# Altium schematic sheet module.SchDoc
size A0
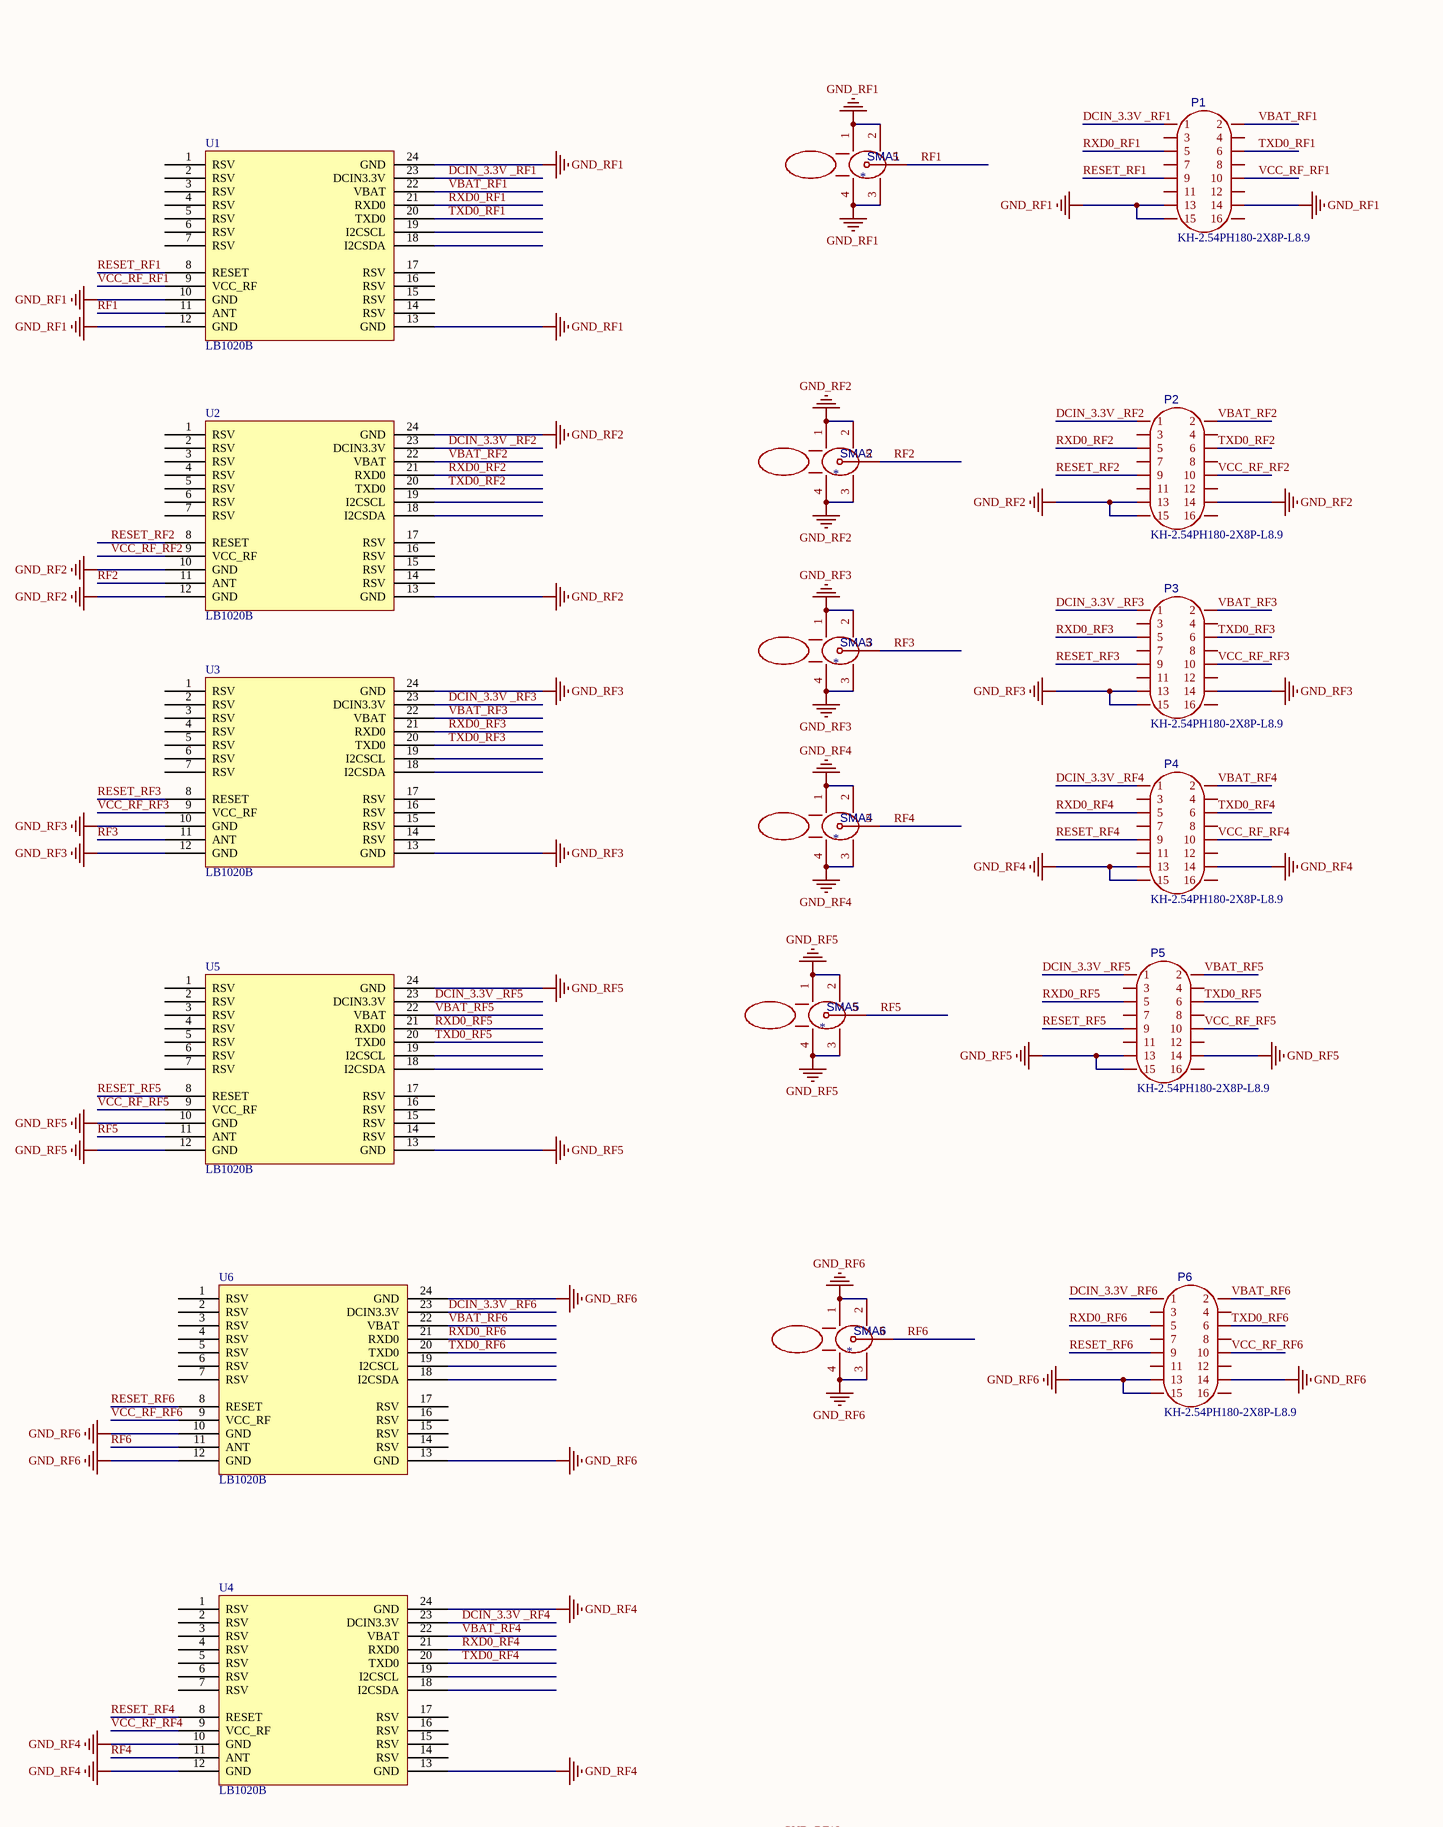
[diagram p0: module.SchDoc, top left]
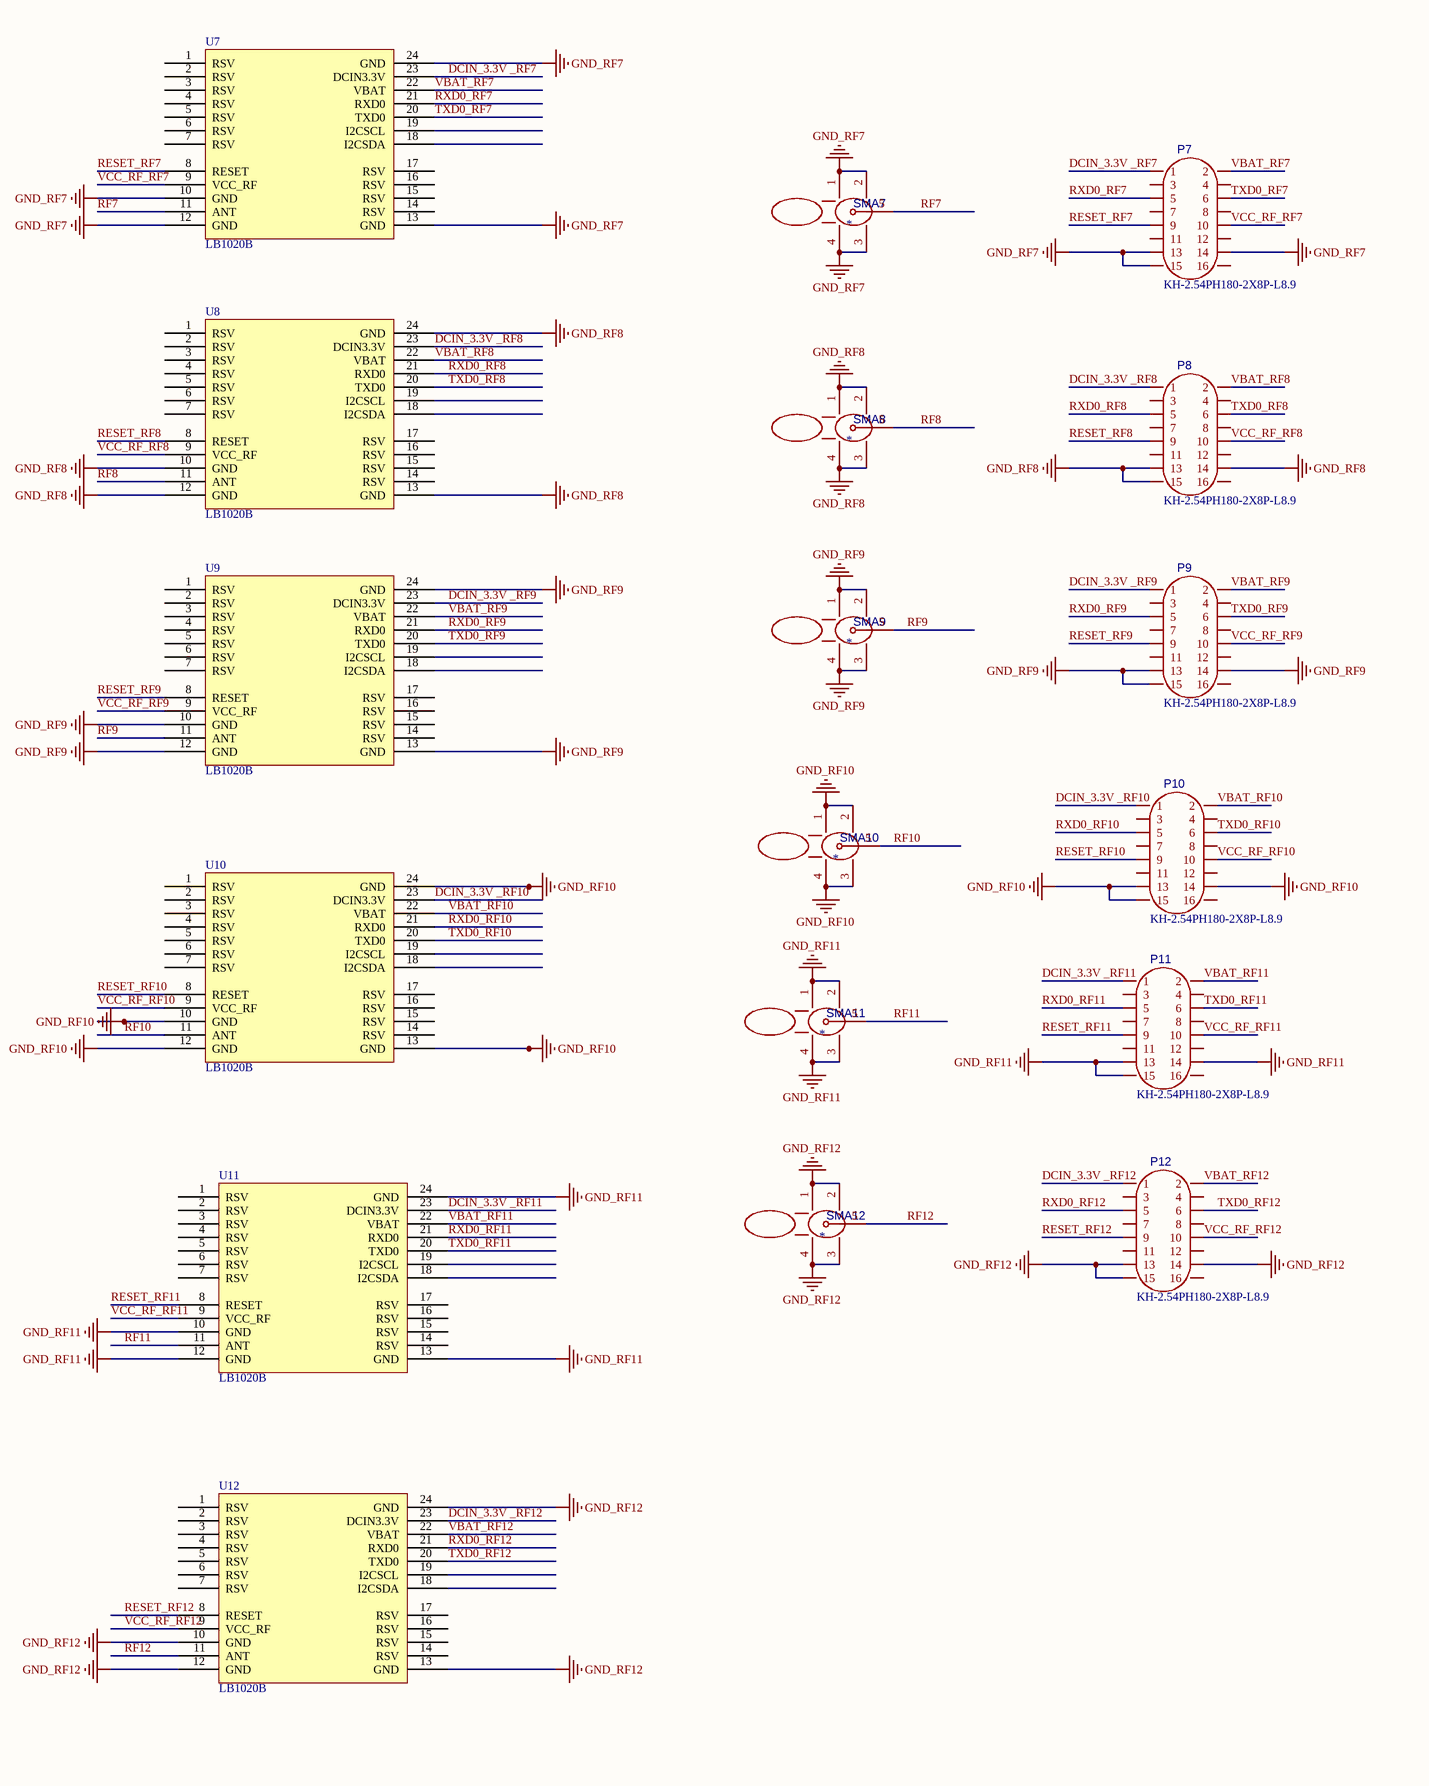
[diagram p1: module.SchDoc, top right]
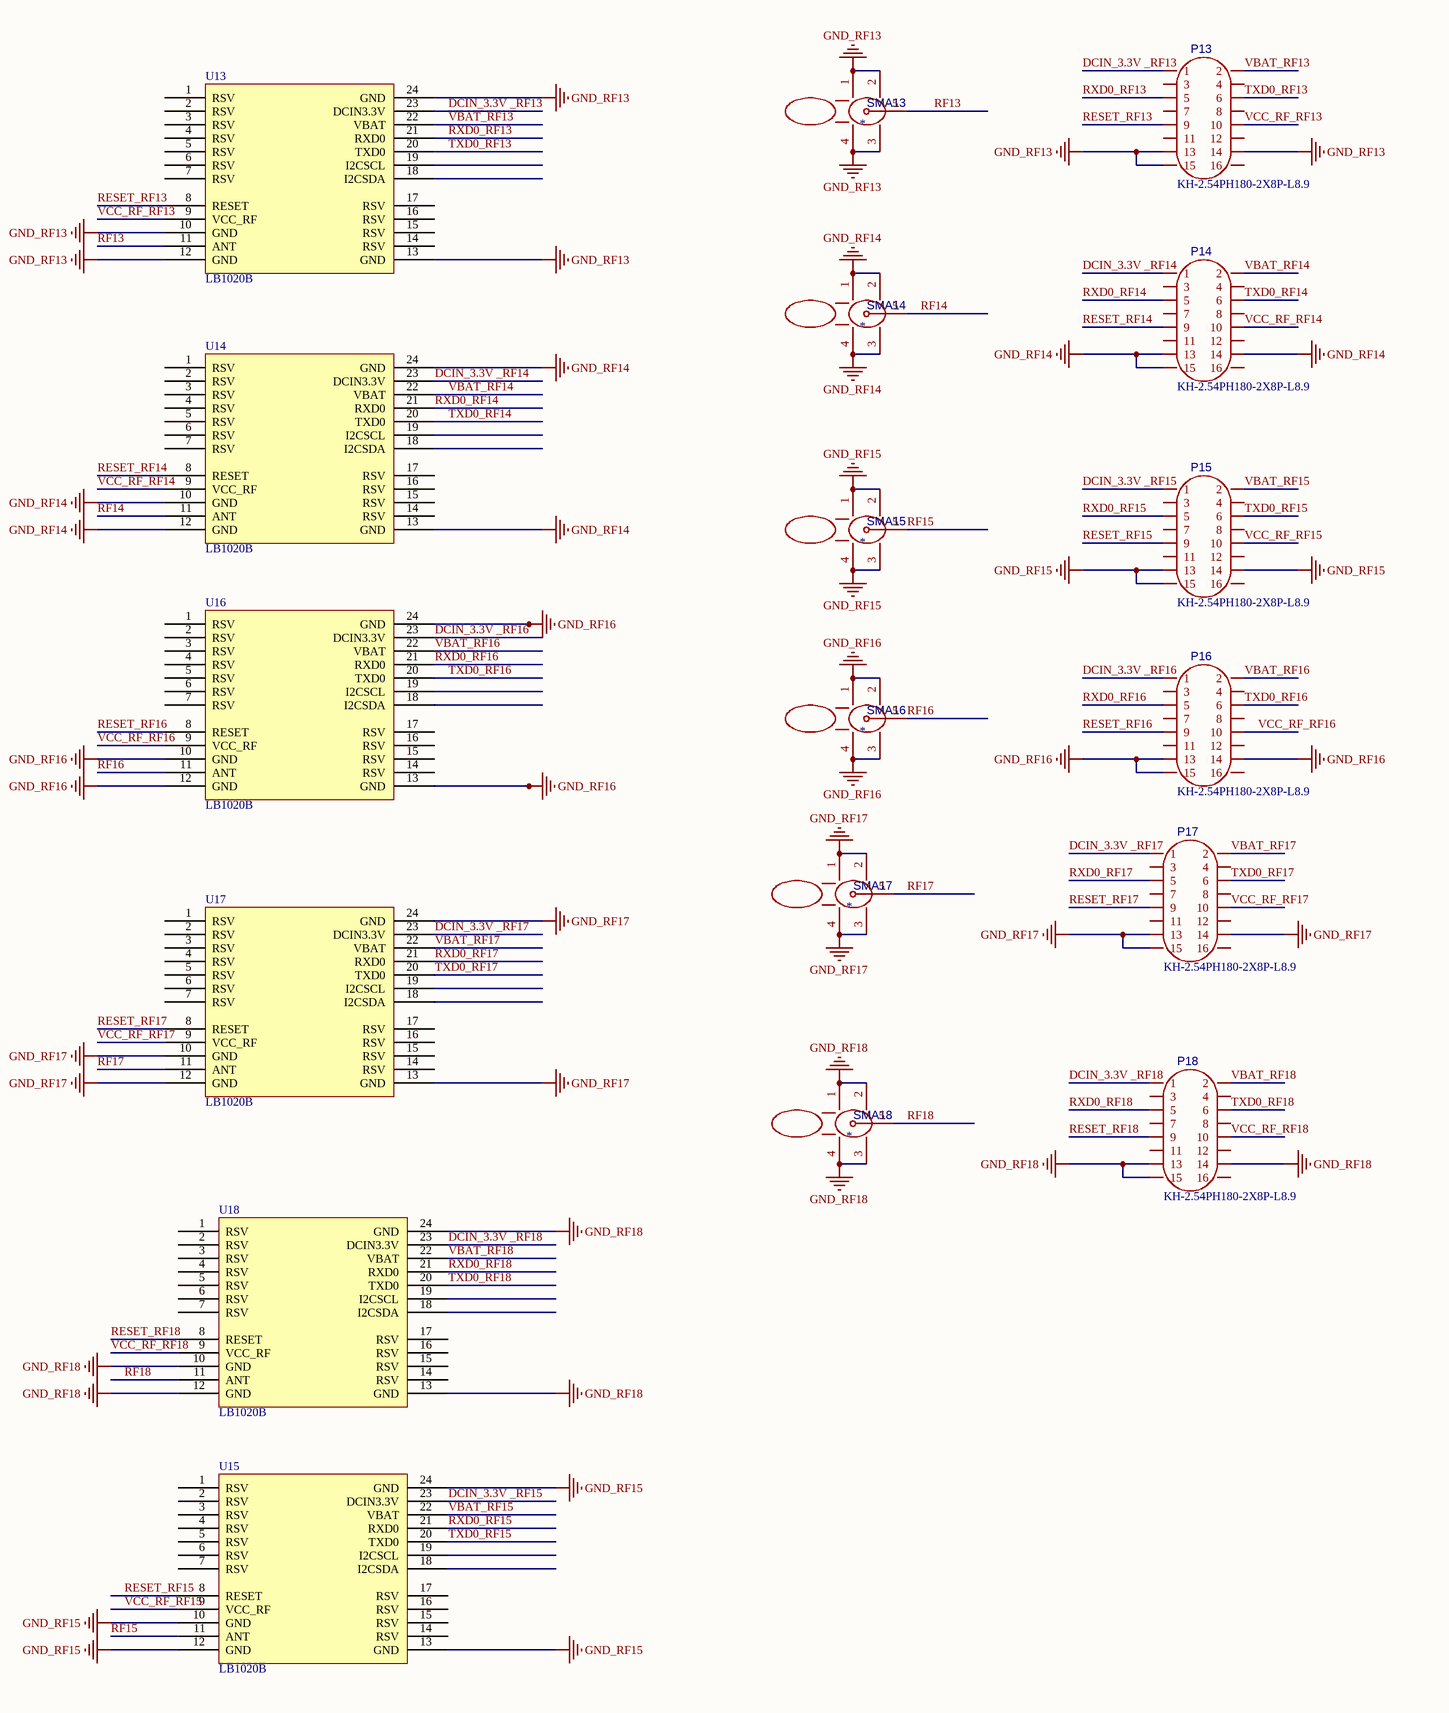
[diagram p2: module.SchDoc, bottom left]
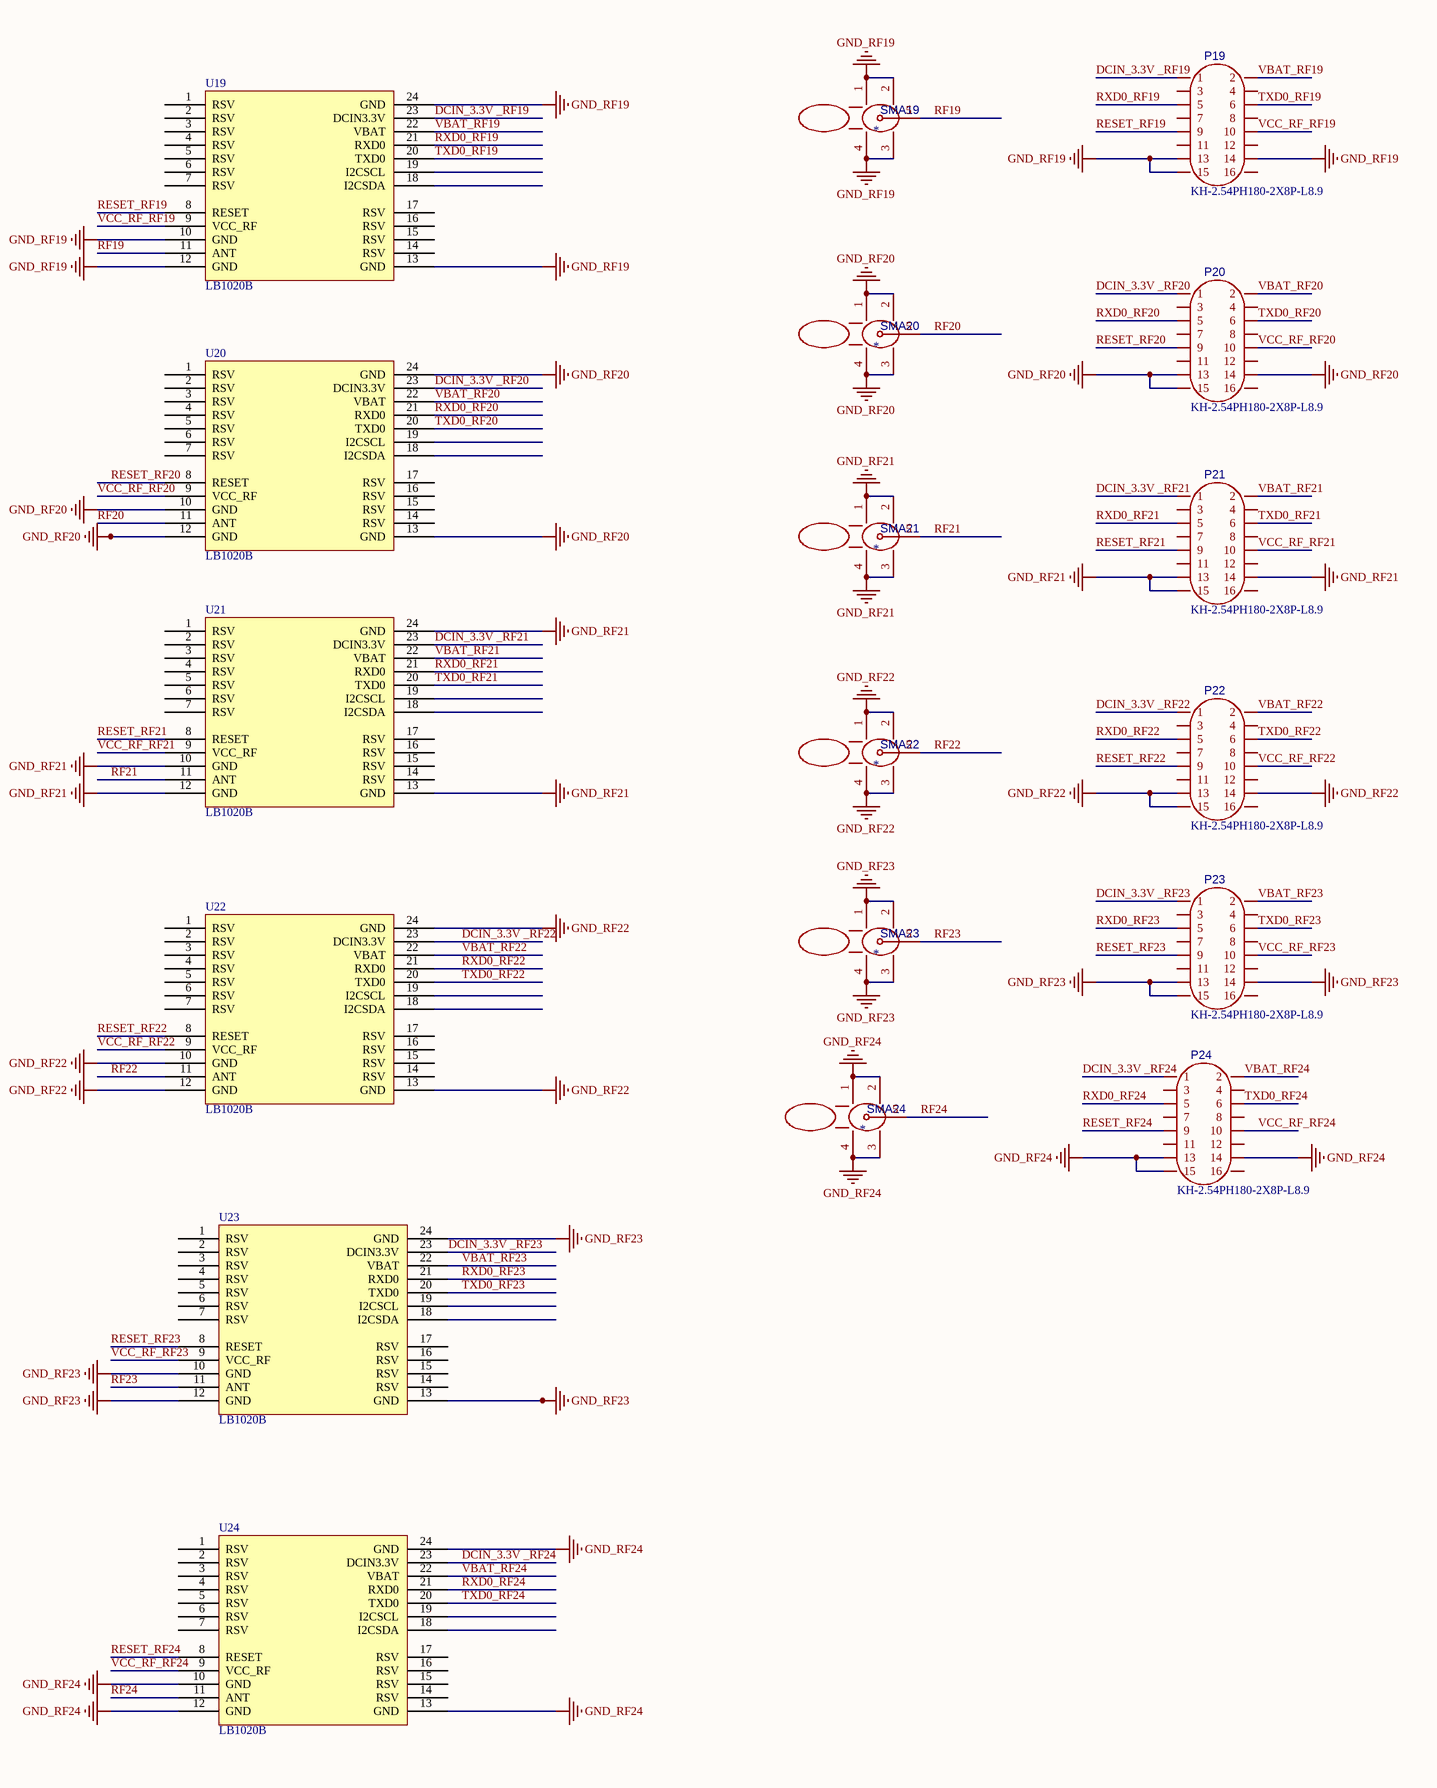
[diagram p3: module.SchDoc, bottom right]

## Parts
P1  KH-2.54PH180-2X8P-L8.9  [IDC-TH_16P-P2.54_C3406]
P2  KH-2.54PH180-2X8P-L8.9  [IDC-TH_16P-P2.54_C3406]
P3  KH-2.54PH180-2X8P-L8.9  [IDC-TH_16P-P2.54_C3406]
P4  KH-2.54PH180-2X8P-L8.9  [IDC-TH_16P-P2.54_C3406]
P5  KH-2.54PH180-2X8P-L8.9  [IDC-TH_16P-P2.54_C3406]
P6  KH-2.54PH180-2X8P-L8.9  [IDC-TH_16P-P2.54_C3406]
P7  KH-2.54PH180-2X8P-L8.9  [IDC-TH_16P-P2.54_C3406]
P8  KH-2.54PH180-2X8P-L8.9  [IDC-TH_16P-P2.54_C3406]
P9  KH-2.54PH180-2X8P-L8.9  [IDC-TH_16P-P2.54_C3406]
P10  KH-2.54PH180-2X8P-L8.9  [IDC-TH_16P-P2.54_C3406]
P11  KH-2.54PH180-2X8P-L8.9  [IDC-TH_16P-P2.54_C3406]
P12  KH-2.54PH180-2X8P-L8.9  [IDC-TH_16P-P2.54_C3406]
P13  KH-2.54PH180-2X8P-L8.9  [IDC-TH_16P-P2.54_C3406]
P14  KH-2.54PH180-2X8P-L8.9  [IDC-TH_16P-P2.54_C3406]
P15  KH-2.54PH180-2X8P-L8.9  [IDC-TH_16P-P2.54_C3406]
P16  KH-2.54PH180-2X8P-L8.9  [IDC-TH_16P-P2.54_C3406]
P17  KH-2.54PH180-2X8P-L8.9  [IDC-TH_16P-P2.54_C3406]
P18  KH-2.54PH180-2X8P-L8.9  [IDC-TH_16P-P2.54_C3406]
P19  KH-2.54PH180-2X8P-L8.9  [IDC-TH_16P-P2.54_C3406]
P20  KH-2.54PH180-2X8P-L8.9  [IDC-TH_16P-P2.54_C3406]
P21  KH-2.54PH180-2X8P-L8.9  [IDC-TH_16P-P2.54_C3406]
P22  KH-2.54PH180-2X8P-L8.9  [IDC-TH_16P-P2.54_C3406]
P23  KH-2.54PH180-2X8P-L8.9  [IDC-TH_16P-P2.54_C3406]
P24  KH-2.54PH180-2X8P-L8.9  [IDC-TH_16P-P2.54_C3406]
SMA1  *  [SMA-TH_HL-SMA-KHD4]
SMA2  *  [SMA-TH_HL-SMA-KHD4]
SMA3  *  [SMA-TH_HL-SMA-KHD4]
SMA4  *  [SMA-TH_HL-SMA-KHD4]
SMA5  *  [SMA-TH_HL-SMA-KHD4]
SMA6  *  [SMA-TH_HL-SMA-KHD4]
SMA7  *  [SMA-TH_HL-SMA-KHD4]
SMA8  *  [SMA-TH_HL-SMA-KHD4]
SMA9  *  [SMA-TH_HL-SMA-KHD4]
SMA10  *  [SMA-TH_HL-SMA-KHD4]
SMA11  *  [SMA-TH_HL-SMA-KHD4]
SMA12  *  [SMA-TH_HL-SMA-KHD4]
SMA13  *  [SMA-TH_HL-SMA-KHD4]
SMA14  *  [SMA-TH_HL-SMA-KHD4]
SMA15  *  [SMA-TH_HL-SMA-KHD4]
SMA16  *  [SMA-TH_HL-SMA-KHD4]
SMA17  *  [SMA-TH_HL-SMA-KHD4]
SMA18  *  [SMA-TH_HL-SMA-KHD4]
SMA19  *  [SMA-TH_HL-SMA-KHD4]
SMA20  *  [SMA-TH_HL-SMA-KHD4]
SMA21  *  [SMA-TH_HL-SMA-KHD4]
SMA22  *  [SMA-TH_HL-SMA-KHD4]
SMA23  *  [SMA-TH_HL-SMA-KHD4]
SMA24  *  [SMA-TH_HL-SMA-KHD4]
U1  LB1020B  [LB1020B]
U2  LB1020B  [LB1020B]
U3  LB1020B  [LB1020B]
U4  LB1020B  [LB1020B]
U5  LB1020B  [LB1020B]
U6  LB1020B  [LB1020B]
U7  LB1020B  [LB1020B]
U8  LB1020B  [LB1020B]
U9  LB1020B  [LB1020B]
U10  LB1020B  [LB1020B]
U11  LB1020B  [LB1020B]
U12  LB1020B  [LB1020B]
U13  LB1020B  [LB1020B]
U14  LB1020B  [LB1020B]
U15  LB1020B  [LB1020B]
U16  LB1020B  [LB1020B]
U17  LB1020B  [LB1020B]
U18  LB1020B  [LB1020B]
U19  LB1020B  [LB1020B]
U20  LB1020B  [LB1020B]
U21  LB1020B  [LB1020B]
U22  LB1020B  [LB1020B]
U23  LB1020B  [LB1020B]
U24  LB1020B  [LB1020B]

## Nets
GND_RF1: P1.13 P1.14 P1.15 SMA1.1 SMA1.2 SMA1.3 SMA1.4 U1.10(GND) U1.12(GND) U1.13(GND) U1.24(GND)
GND_RF2: P2.13 P2.14 P2.15 SMA2.1 SMA2.2 SMA2.3 SMA2.4 U2.10(GND) U2.12(GND) U2.13(GND) U2.24(GND)
GND_RF3: P3.13 P3.14 P3.15 SMA3.1 SMA3.2 SMA3.3 SMA3.4 U3.10(GND) U3.12(GND) U3.13(GND) U3.24(GND)
GND_RF4: P4.13 P4.14 P4.15 SMA4.1 SMA4.2 SMA4.3 SMA4.4 U4.10(GND) U4.12(GND) U4.13(GND) U4.24(GND)
GND_RF5: P5.13 P5.14 P5.15 SMA5.1 SMA5.2 SMA5.3 SMA5.4 U5.10(GND) U5.12(GND) U5.13(GND) U5.24(GND)
GND_RF6: P6.13 P6.14 P6.15 SMA6.1 SMA6.2 SMA6.3 SMA6.4 U6.10(GND) U6.12(GND) U6.13(GND) U6.24(GND)
GND_RF7: P7.13 P7.14 P7.15 SMA7.1 SMA7.2 SMA7.3 SMA7.4 U7.10(GND) U7.12(GND) U7.13(GND) U7.24(GND)
GND_RF8: P8.13 P8.14 P8.15 SMA8.1 SMA8.2 SMA8.3 SMA8.4 U8.10(GND) U8.12(GND) U8.13(GND) U8.24(GND)
GND_RF9: P9.13 P9.14 P9.15 SMA9.1 SMA9.2 SMA9.3 SMA9.4 U9.10(GND) U9.12(GND) U9.13(GND) U9.24(GND)
GND_RF10: P10.13 P10.14 P10.15 SMA10.1 SMA10.2 SMA10.3 SMA10.4 U10.10(GND) U10.12(GND) U10.13(GND) U10.24(GND)
GND_RF11: P11.13 P11.14 P11.15 SMA11.1 SMA11.2 SMA11.3 SMA11.4 U11.10(GND) U11.12(GND) U11.13(GND) U11.24(GND)
GND_RF12: P12.13 P12.14 P12.15 SMA12.1 SMA12.2 SMA12.3 SMA12.4 U12.10(GND) U12.12(GND) U12.13(GND) U12.24(GND)
GND_RF13: P13.13 P13.14 P13.15 SMA13.1 SMA13.2 SMA13.3 SMA13.4 U13.10(GND) U13.12(GND) U13.13(GND) U13.24(GND)
GND_RF14: P14.13 P14.14 P14.15 SMA14.1 SMA14.2 SMA14.3 SMA14.4 U14.10(GND) U14.12(GND) U14.13(GND) U14.24(GND)
GND_RF15: P15.13 P15.14 P15.15 SMA15.1 SMA15.2 SMA15.3 SMA15.4 U15.10(GND) U15.12(GND) U15.13(GND) U15.24(GND)
GND_RF16: P16.13 P16.14 P16.15 SMA16.1 SMA16.2 SMA16.3 SMA16.4 U16.10(GND) U16.12(GND) U16.13(GND) U16.24(GND)
GND_RF17: P17.13 P17.14 P17.15 SMA17.1 SMA17.2 SMA17.3 SMA17.4 U17.10(GND) U17.12(GND) U17.13(GND) U17.24(GND)
GND_RF18: P18.13 P18.14 P18.15 SMA18.1 SMA18.2 SMA18.3 SMA18.4 U18.10(GND) U18.12(GND) U18.13(GND) U18.24(GND)
GND_RF19: P19.13 P19.14 P19.15 SMA19.1 SMA19.2 SMA19.3 SMA19.4 U19.10(GND) U19.12(GND) U19.13(GND) U19.24(GND)
GND_RF20: P20.13 P20.14 P20.15 SMA20.1 SMA20.2 SMA20.3 SMA20.4 U20.10(GND) U20.12(GND) U20.13(GND) U20.24(GND)
GND_RF21: P21.13 P21.14 P21.15 SMA21.1 SMA21.2 SMA21.3 SMA21.4 U21.10(GND) U21.12(GND) U21.13(GND) U21.24(GND)
GND_RF22: P22.13 P22.14 P22.15 SMA22.1 SMA22.2 SMA22.3 SMA22.4 U22.10(GND) U22.12(GND) U22.13(GND) U22.24(GND)
GND_RF23: P23.13 P23.14 P23.15 SMA23.1 SMA23.2 SMA23.3 SMA23.4 U23.10(GND) U23.12(GND) U23.13(GND) U23.24(GND)
GND_RF24: P24.13 P24.14 P24.15 SMA24.1 SMA24.2 SMA24.3 SMA24.4 U24.10(GND) U24.12(GND) U24.13(GND) U24.24(GND)
DCIN_3.3V _RF1: P1.1 U1.23(DCIN3.3V)
DCIN_3.3V _RF2: P2.1 U2.23(DCIN3.3V)
DCIN_3.3V _RF3: P3.1 U3.23(DCIN3.3V)
DCIN_3.3V _RF4: P4.1 U4.23(DCIN3.3V)
DCIN_3.3V _RF5: P5.1 U5.23(DCIN3.3V)
DCIN_3.3V _RF6: P6.1 U6.23(DCIN3.3V)
DCIN_3.3V _RF7: P7.1 U7.23(DCIN3.3V)
DCIN_3.3V _RF8: P8.1 U8.23(DCIN3.3V)
DCIN_3.3V _RF9: P9.1 U9.23(DCIN3.3V)
DCIN_3.3V _RF10: P10.1 U10.23(DCIN3.3V)
DCIN_3.3V _RF11: P11.1 U11.23(DCIN3.3V)
DCIN_3.3V _RF12: P12.1 U12.23(DCIN3.3V)
DCIN_3.3V _RF13: P13.1 U13.23(DCIN3.3V)
DCIN_3.3V _RF14: P14.1 U14.23(DCIN3.3V)
DCIN_3.3V _RF15: P15.1 U15.23(DCIN3.3V)
DCIN_3.3V _RF16: P16.1 U16.23(DCIN3.3V)
DCIN_3.3V _RF17: P17.1 U17.23(DCIN3.3V)
DCIN_3.3V _RF18: P18.1 U18.23(DCIN3.3V)
DCIN_3.3V _RF19: P19.1 U19.23(DCIN3.3V)
DCIN_3.3V _RF20: P20.1 U20.23(DCIN3.3V)
DCIN_3.3V _RF21: P21.1 U21.23(DCIN3.3V)
DCIN_3.3V _RF22: P22.1 U22.23(DCIN3.3V)
DCIN_3.3V _RF23: P23.1 U23.23(DCIN3.3V)
DCIN_3.3V _RF24: P24.1 U24.23(DCIN3.3V)
RESET_RF1: P1.9 U1.8(RESET)
RESET_RF2: P2.9 U2.8(RESET)
RESET_RF3: P3.9 U3.8(RESET)
RESET_RF4: P4.9 U4.8(RESET)
RESET_RF5: P5.9 U5.8(RESET)
RESET_RF6: P6.9 U6.8(RESET)
RESET_RF7: P7.9 U7.8(RESET)
RESET_RF8: P8.9 U8.8(RESET)
RESET_RF9: P9.9 U9.8(RESET)
RESET_RF10: P10.9 U10.8(RESET)
RESET_RF11: P11.9 U11.8(RESET)
RESET_RF12: P12.9 U12.8(RESET)
RESET_RF13: P13.9 U13.8(RESET)
RESET_RF14: P14.9 U14.8(RESET)
RESET_RF15: P15.9 U15.8(RESET)
RESET_RF16: P16.9 U16.8(RESET)
RESET_RF17: P17.9 U17.8(RESET)
RESET_RF18: P18.9 U18.8(RESET)
RESET_RF19: P19.9 U19.8(RESET)
RESET_RF20: P20.9 U20.8(RESET)
RESET_RF21: P21.9 U21.8(RESET)
RESET_RF22: P22.9 U22.8(RESET)
RESET_RF23: P23.9 U23.8(RESET)
RESET_RF24: P24.9 U24.8(RESET)
RF1: SMA1.5 U1.11(ANT)
RF2: SMA2.5 U2.11(ANT)
RF3: SMA3.5 U3.11(ANT)
RF4: SMA4.5 U4.11(ANT)
RF5: SMA5.5 U5.11(ANT)
RF6: SMA6.5 U6.11(ANT)
RF7: SMA7.5 U7.11(ANT)
RF8: SMA8.5 U8.11(ANT)
RF9: SMA9.5 U9.11(ANT)
RF10: SMA10.5 U10.11(ANT)
RF11: SMA11.5 U11.11(ANT)
RF12: SMA12.5 U12.11(ANT)
RF13: SMA13.5 U13.11(ANT)
RF14: SMA14.5 U14.11(ANT)
RF15: SMA15.5 U15.11(ANT)
RF16: SMA16.5 U16.11(ANT)
RF17: SMA17.5 U17.11(ANT)
RF18: SMA18.5 U18.11(ANT)
RF19: SMA19.5 U19.11(ANT)
RF20: SMA20.5 U20.11(ANT)
RF21: SMA21.5 U21.11(ANT)
RF22: SMA22.5 U22.11(ANT)
RF23: SMA23.5 U23.11(ANT)
RF24: SMA24.5 U24.11(ANT)
RXD0_RF1: P1.5 U1.21(RXD0)
RXD0_RF2: P2.5 U2.21(RXD0)
RXD0_RF3: P3.5 U3.21(RXD0)
RXD0_RF4: P4.5 U4.21(RXD0)
RXD0_RF5: P5.5 U5.21(RXD0)
RXD0_RF6: P6.5 U6.21(RXD0)
RXD0_RF7: P7.5 U7.21(RXD0)
RXD0_RF8: P8.5 U8.21(RXD0)
RXD0_RF9: P9.5 U9.21(RXD0)
RXD0_RF10: P10.5 U10.21(RXD0)
RXD0_RF11: P11.5 U11.21(RXD0)
RXD0_RF12: P12.5 U12.21(RXD0)
RXD0_RF13: P13.5 U13.21(RXD0)
RXD0_RF14: P14.5 U14.21(RXD0)
RXD0_RF15: P15.5 U15.21(RXD0)
RXD0_RF16: P16.5 U16.21(RXD0)
RXD0_RF17: P17.5 U17.21(RXD0)
RXD0_RF18: P18.5 U18.21(RXD0)
RXD0_RF19: P19.5 U19.21(RXD0)
RXD0_RF20: P20.5 U20.21(RXD0)
RXD0_RF21: P21.5 U21.21(RXD0)
RXD0_RF22: P22.5 U22.21(RXD0)
RXD0_RF23: P23.5 U23.21(RXD0)
RXD0_RF24: P24.5 U24.21(RXD0)
TXD0_RF1: P1.6 U1.20(TXD0)
TXD0_RF2: P2.6 U2.20(TXD0)
TXD0_RF3: P3.6 U3.20(TXD0)
TXD0_RF4: P4.6 U4.20(TXD0)
TXD0_RF5: P5.6 U5.20(TXD0)
TXD0_RF6: P6.6 U6.20(TXD0)
TXD0_RF7: P7.6 U7.20(TXD0)
TXD0_RF8: P8.6 U8.20(TXD0)
TXD0_RF9: P9.6 U9.20(TXD0)
TXD0_RF10: P10.6 U10.20(TXD0)
TXD0_RF11: P11.6 U11.20(TXD0)
TXD0_RF12: P12.6 U12.20(TXD0)
TXD0_RF13: P13.6 U13.20(TXD0)
TXD0_RF14: P14.6 U14.20(TXD0)
TXD0_RF15: P15.6 U15.20(TXD0)
TXD0_RF16: P16.6 U16.20(TXD0)
TXD0_RF17: P17.6 U17.20(TXD0)
TXD0_RF18: P18.6 U18.20(TXD0)
TXD0_RF19: P19.6 U19.20(TXD0)
TXD0_RF20: P20.6 U20.20(TXD0)
TXD0_RF21: P21.6 U21.20(TXD0)
TXD0_RF22: P22.6 U22.20(TXD0)
TXD0_RF23: P23.6 U23.20(TXD0)
TXD0_RF24: P24.6 U24.20(TXD0)
VBAT_RF1: P1.2 U1.22(VBAT)
VBAT_RF2: P2.2 U2.22(VBAT)
VBAT_RF3: P3.2 U3.22(VBAT)
VBAT_RF4: P4.2 U4.22(VBAT)
VBAT_RF5: P5.2 U5.22(VBAT)
VBAT_RF6: P6.2 U6.22(VBAT)
VBAT_RF7: P7.2 U7.22(VBAT)
VBAT_RF8: P8.2 U8.22(VBAT)
VBAT_RF9: P9.2 U9.22(VBAT)
VBAT_RF10: P10.2 U10.22(VBAT)
VBAT_RF11: P11.2 U11.22(VBAT)
VBAT_RF12: P12.2 U12.22(VBAT)
VBAT_RF13: P13.2 U13.22(VBAT)
VBAT_RF14: P14.2 U14.22(VBAT)
VBAT_RF15: P15.2 U15.22(VBAT)
VBAT_RF16: P16.2 U16.22(VBAT)
VBAT_RF17: P17.2 U17.22(VBAT)
VBAT_RF18: P18.2 U18.22(VBAT)
VBAT_RF19: P19.2 U19.22(VBAT)
VBAT_RF20: P20.2 U20.22(VBAT)
VBAT_RF21: P21.2 U21.22(VBAT)
VBAT_RF22: P22.2 U22.22(VBAT)
VBAT_RF23: P23.2 U23.22(VBAT)
VBAT_RF24: P24.2 U24.22(VBAT)
VCC_RF_RF1: P1.10 U1.9(VCC_RF)
VCC_RF_RF2: P2.10 U2.9(VCC_RF)
VCC_RF_RF3: P3.10 U3.9(VCC_RF)
VCC_RF_RF4: P4.10 U4.9(VCC_RF)
VCC_RF_RF5: P5.10 U5.9(VCC_RF)
VCC_RF_RF6: P6.10 U6.9(VCC_RF)
VCC_RF_RF7: P7.10 U7.9(VCC_RF)
VCC_RF_RF8: P8.10 U8.9(VCC_RF)
VCC_RF_RF9: P9.10 U9.9(VCC_RF)
VCC_RF_RF10: P10.10 U10.9(VCC_RF)
VCC_RF_RF11: P11.10 U11.9(VCC_RF)
VCC_RF_RF12: P12.10 U12.9(VCC_RF)
VCC_RF_RF13: P13.10 U13.9(VCC_RF)
VCC_RF_RF14: P14.10 U14.9(VCC_RF)
VCC_RF_RF15: P15.10 U15.9(VCC_RF)
VCC_RF_RF16: P16.10 U16.9(VCC_RF)
VCC_RF_RF17: P17.10 U17.9(VCC_RF)
VCC_RF_RF18: P18.10 U18.9(VCC_RF)
VCC_RF_RF19: P19.10 U19.9(VCC_RF)
VCC_RF_RF20: P20.10 U20.9(VCC_RF)
VCC_RF_RF21: P21.10 U21.9(VCC_RF)
VCC_RF_RF22: P22.10 U22.9(VCC_RF)
VCC_RF_RF23: P23.10 U23.9(VCC_RF)
VCC_RF_RF24: P24.10 U24.9(VCC_RF)

Not connected (* = marked no-connect by the designer): P1 3 4 7 8 11 12 16; P2 3 4 7 8 11 12 16; P3 3 4 7 8 11 12 16; P4 3 4 7 8 11 12 16; P5 3 4 7 8 11 12 16; P6 3 4 7 8 11 12 16; P7 3 4 7 8 11 12 16; P8 3 4 7 8 11 12 16; P9 3 4 7 8 11 12 16; P10 3 4 7 8 11 12 16; P11 3 4 7 8 11 12 16; P12 3 4 7 8 11 12 16; P13 3 4 7 8 11 12 16; P14 3 4 7 8 11 12 16; P15 3 4 7 8 11 12 16; P16 3 4 7 8 11 12 16; P17 3 4 7 8 11 12 16; P18 3 4 7 8 11 12 16; P19 3 4 7 8 11 12 16; P20 3 4 7 8 11 12 16; P21 3 4 7 8 11 12 16; P22 3 4 7 8 11 12 16; P23 3 4 7 8 11 12 16; P24 3 4 7 8 11 12 16; U1 1(RSV) 2(RSV) 3(RSV) 4(RSV) 5(RSV) 6(RSV) 7(RSV) 14(RSV) 15(RSV) 16(RSV) 17(RSV) 18(I2CSDA) 19(I2CSCL); U2 1(RSV) 2(RSV) 3(RSV) 4(RSV) 5(RSV) 6(RSV) 7(RSV) 14(RSV) 15(RSV) 16(RSV) 17(RSV) 18(I2CSDA) 19(I2CSCL); U3 1(RSV) 2(RSV) 3(RSV) 4(RSV) 5(RSV) 6(RSV) 7(RSV) 14(RSV) 15(RSV) 16(RSV) 17(RSV) 18(I2CSDA) 19(I2CSCL); U4 1(RSV) 2(RSV) 3(RSV) 4(RSV) 5(RSV) 6(RSV) 7(RSV) 14(RSV) 15(RSV) 16(RSV) 17(RSV) 18(I2CSDA) 19(I2CSCL); U5 1(RSV) 2(RSV) 3(RSV) 4(RSV) 5(RSV) 6(RSV) 7(RSV) 14(RSV) 15(RSV) 16(RSV) 17(RSV) 18(I2CSDA) 19(I2CSCL); U6 1(RSV) 2(RSV) 3(RSV) 4(RSV) 5(RSV) 6(RSV) 7(RSV) 14(RSV) 15(RSV) 16(RSV) 17(RSV) 18(I2CSDA) 19(I2CSCL); U7 1(RSV) 2(RSV) 3(RSV) 4(RSV) 5(RSV) 6(RSV) 7(RSV) 14(RSV) 15(RSV) 16(RSV) 17(RSV) 18(I2CSDA) 19(I2CSCL); U8 1(RSV) 2(RSV) 3(RSV) 4(RSV) 5(RSV) 6(RSV) 7(RSV) 14(RSV) 15(RSV) 16(RSV) 17(RSV) 18(I2CSDA) 19(I2CSCL); U9 1(RSV) 2(RSV) 3(RSV) 4(RSV) 5(RSV) 6(RSV) 7(RSV) 14(RSV) 15(RSV) 16(RSV) 17(RSV) 18(I2CSDA) 19(I2CSCL); U10 1(RSV) 2(RSV) 3(RSV) 4(RSV) 5(RSV) 6(RSV) 7(RSV) 14(RSV) 15(RSV) 16(RSV) 17(RSV) 18(I2CSDA) 19(I2CSCL); U11 1(RSV) 2(RSV) 3(RSV) 4(RSV) 5(RSV) 6(RSV) 7(RSV) 14(RSV) 15(RSV) 16(RSV) 17(RSV) 18(I2CSDA) 19(I2CSCL); U12 1(RSV) 2(RSV) 3(RSV) 4(RSV) 5(RSV) 6(RSV) 7(RSV) 14(RSV) 15(RSV) 16(RSV) 17(RSV) 18(I2CSDA) 19(I2CSCL); U13 1(RSV) 2(RSV) 3(RSV) 4(RSV) 5(RSV) 6(RSV) 7(RSV) 14(RSV) 15(RSV) 16(RSV) 17(RSV) 18(I2CSDA) 19(I2CSCL); U14 1(RSV) 2(RSV) 3(RSV) 4(RSV) 5(RSV) 6(RSV) 7(RSV) 14(RSV) 15(RSV) 16(RSV) 17(RSV) 18(I2CSDA) 19(I2CSCL); U15 1(RSV) 2(RSV) 3(RSV) 4(RSV) 5(RSV) 6(RSV) 7(RSV) 14(RSV) 15(RSV) 16(RSV) 17(RSV) 18(I2CSDA) 19(I2CSCL); U16 1(RSV) 2(RSV) 3(RSV) 4(RSV) 5(RSV) 6(RSV) 7(RSV) 14(RSV) 15(RSV) 16(RSV) 17(RSV) 18(I2CSDA) 19(I2CSCL); U17 1(RSV) 2(RSV) 3(RSV) 4(RSV) 5(RSV) 6(RSV) 7(RSV) 14(RSV) 15(RSV) 16(RSV) 17(RSV) 18(I2CSDA) 19(I2CSCL); U18 1(RSV) 2(RSV) 3(RSV) 4(RSV) 5(RSV) 6(RSV) 7(RSV) 14(RSV) 15(RSV) 16(RSV) 17(RSV) 18(I2CSDA) 19(I2CSCL); U19 1(RSV) 2(RSV) 3(RSV) 4(RSV) 5(RSV) 6(RSV) 7(RSV) 14(RSV) 15(RSV) 16(RSV) 17(RSV) 18(I2CSDA) 19(I2CSCL); U20 1(RSV) 2(RSV) 3(RSV) 4(RSV) 5(RSV) 6(RSV) 7(RSV) 14(RSV) 15(RSV) 16(RSV) 17(RSV) 18(I2CSDA) 19(I2CSCL); U21 1(RSV) 2(RSV) 3(RSV) 4(RSV) 5(RSV) 6(RSV) 7(RSV) 14(RSV) 15(RSV) 16(RSV) 17(RSV) 18(I2CSDA) 19(I2CSCL); U22 1(RSV) 2(RSV) 3(RSV) 4(RSV) 5(RSV) 6(RSV) 7(RSV) 14(RSV) 15(RSV) 16(RSV) 17(RSV) 18(I2CSDA) 19(I2CSCL); U23 1(RSV) 2(RSV) 3(RSV) 4(RSV) 5(RSV) 6(RSV) 7(RSV) 14(RSV) 15(RSV) 16(RSV) 17(RSV) 18(I2CSDA) 19(I2CSCL); U24 1(RSV) 2(RSV) 3(RSV) 4(RSV) 5(RSV) 6(RSV) 7(RSV) 14(RSV) 15(RSV) 16(RSV) 17(RSV) 18(I2CSDA) 19(I2CSCL)

## Library data of the parts
P1-P24 = HDR-IDC-2.54-2X8P: Symbol: HDR-IDC-2.54-2X8P
SMA1-SMA24 = HL-SMA-KHD4: Symbol: HL-SMA-KHD4